# Altium schematic sheet shematic diagram.SchDoc (part 1 of 3)
size A2; SheetNumber: 1; SheetTotal: 1
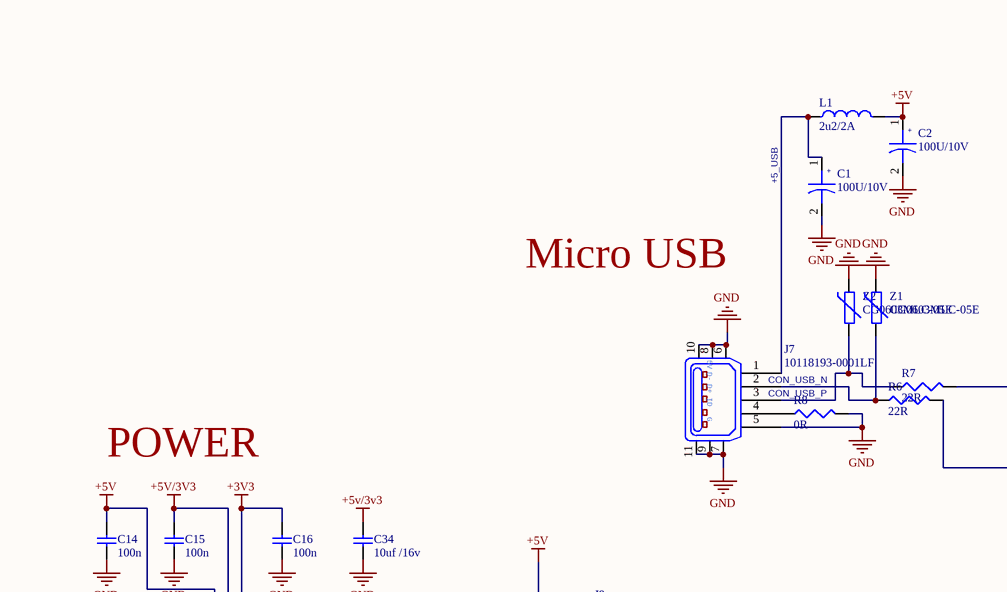
[diagram p0: shematic diagram.SchDoc, top left]
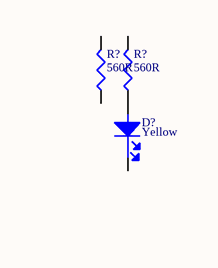
[diagram p1: shematic diagram.SchDoc, top right]
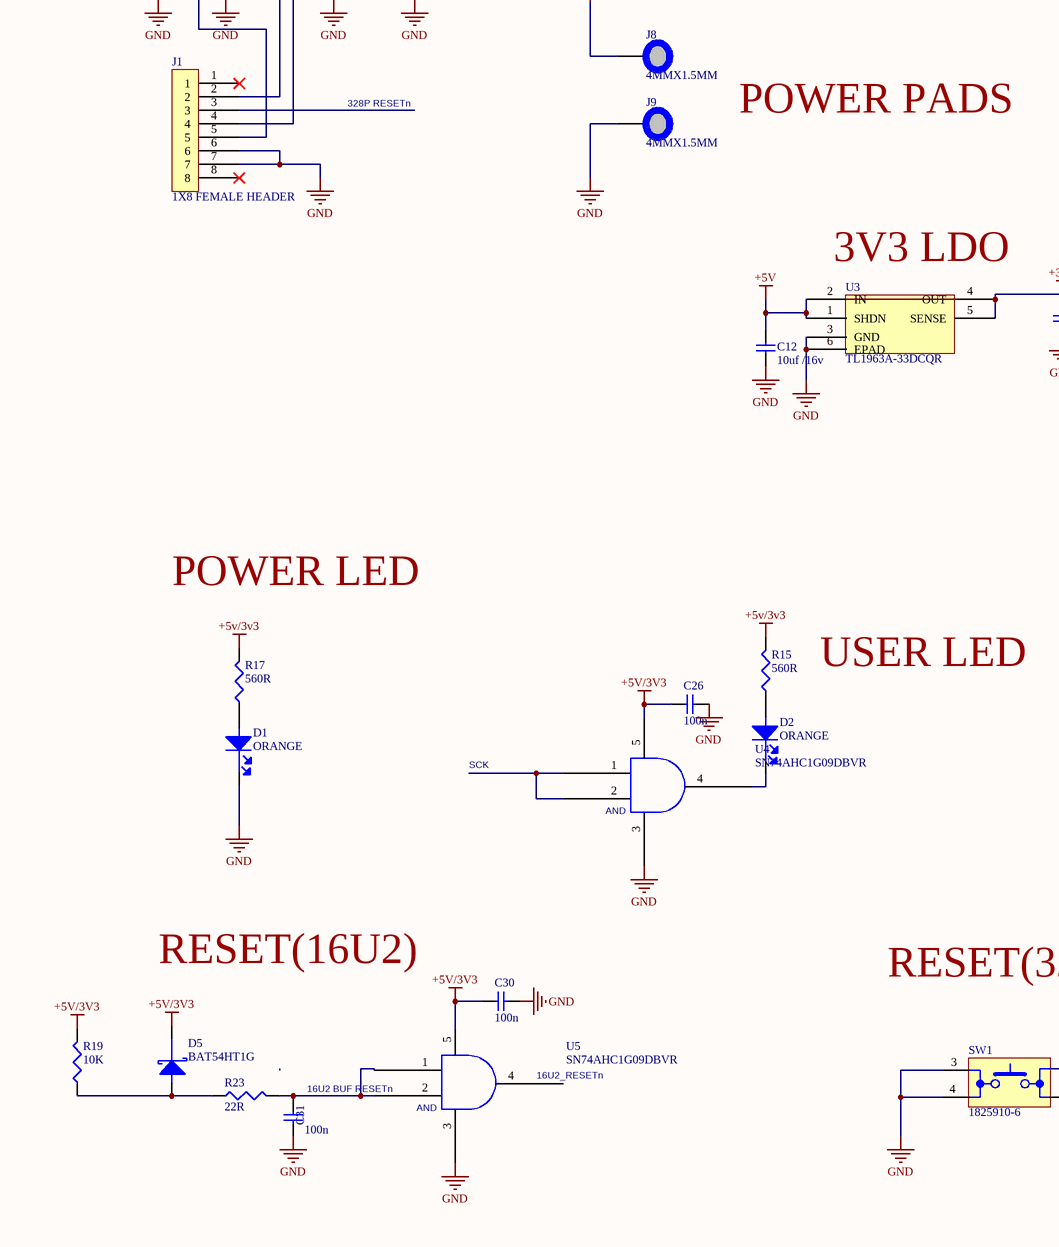
[diagram p2: shematic diagram.SchDoc, bottom left]
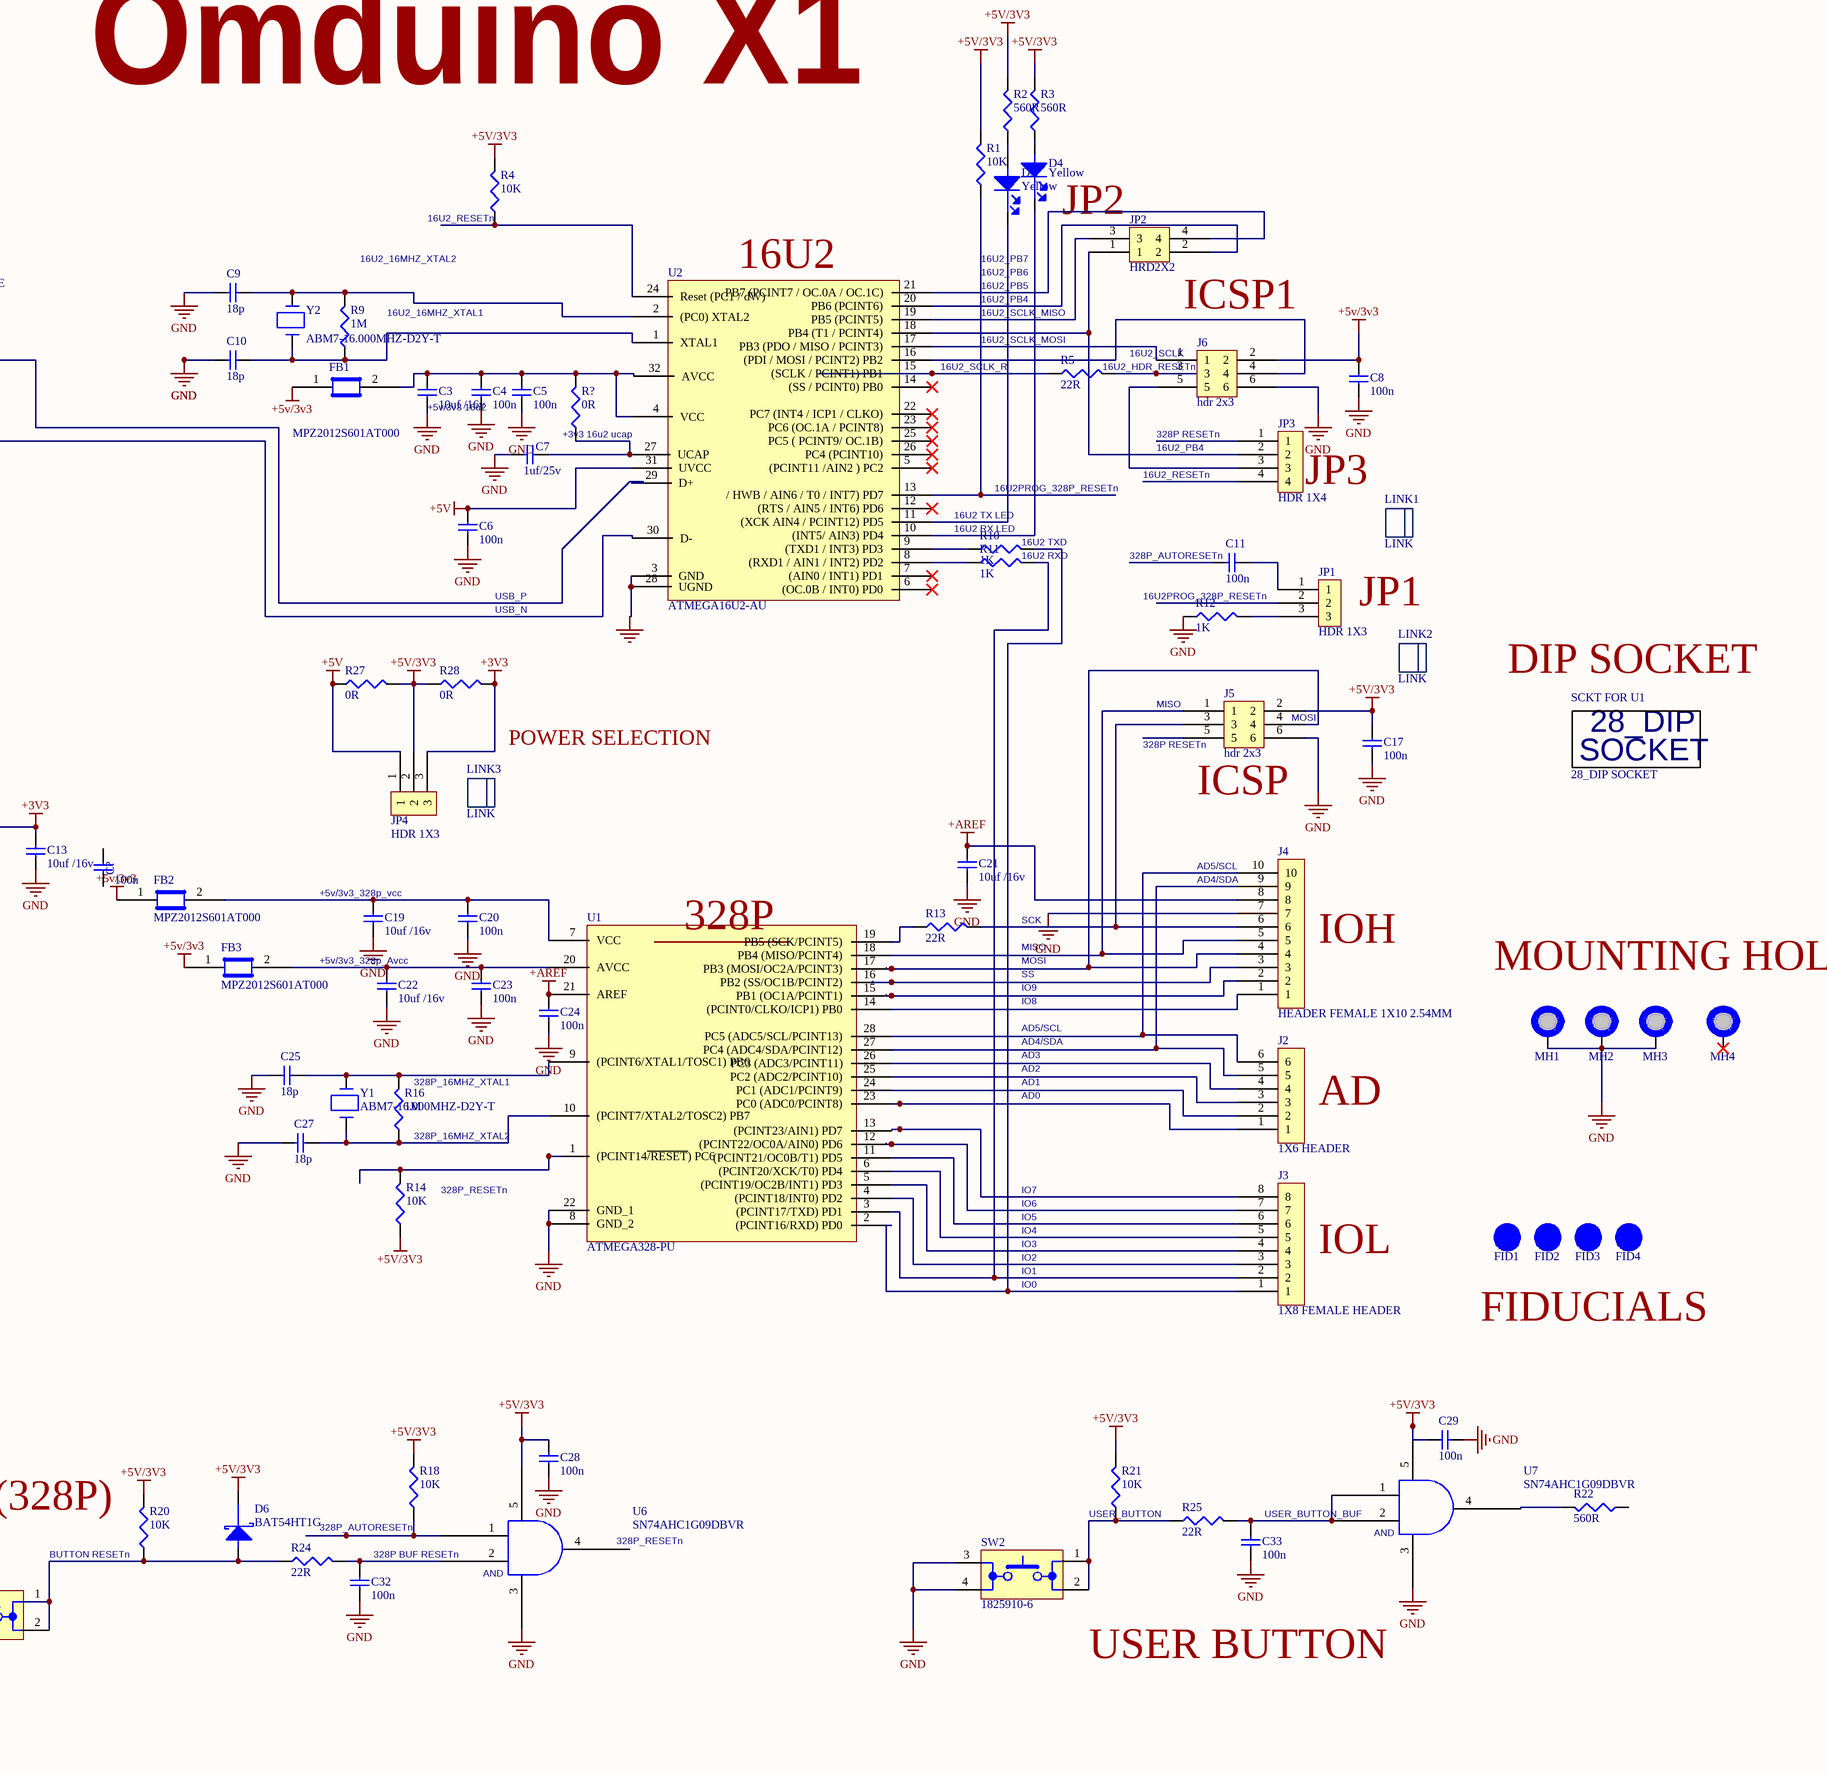
[diagram p3: shematic diagram.SchDoc, bottom right]

## Parts
(Parts that share a designator on the sheet are numbered #1, #2 ... from top to bottom, then left to right.)
C1  100U/10V  [C_ALU_C_SIZE]
C2  100U/10V  [C_ALU_C_SIZE]
C3  10uf /16v  [10uf /c0805 footprint]
C4  100n  [c0805 footprint - duplicate]
C5  100n  [c0805 footprint - duplicate]
C6  100n  [c0805 footprint - duplicate]
C7  1uf/25v  [c0805 footprint - duplicate]
C8  100n  [c0805 footprint - duplicate]
C9  18p  [c0805 footprint - duplicate]
C10  18p  [c0805 footprint - duplicate]
C11  100n  [c0805 footprint - duplicate]
C12  10uf /16v  [10uf /c0805 footprint]
C13  10uf /16v  [10uf /c0805 footprint]
C14  100n  [c0805 footprint - duplicate]
C15  100n  [c0805 footprint - duplicate]
C16  100n  [c0805 footprint - duplicate]
C17  100n  [c0805 footprint - duplicate]
C19  10uf /16v  [10uf /c0805 footprint]
C20  100n  [c0805 footprint - duplicate]
C21  10uf /16v  [10uf /c0805 footprint]
C22  10uf /16v  [10uf /c0805 footprint]
C23  100n  [c0805 footprint - duplicate]
C24  100n  [c0805 footprint - duplicate]
C25  18p  [c0805 footprint - duplicate]
C26  100n  [c0805 footprint - duplicate]
C27  18p  [c0805 footprint - duplicate]
C28  100n  [c0805 footprint - duplicate]
C29  100n  [c0805 footprint - duplicate]
C30  100n  [c0805 footprint - duplicate]
C31  100n  [c0805 footprint - duplicate]
C32  100n  [c0805 footprint - duplicate]
C33  100n  [c0805 footprint - duplicate]
C34  10uf /16v  [10uf /c0805 footprint]
C?  100n  [c0805 footprint - duplicate]
D1  ORANGE  [led_0603]
D2  ORANGE  [led_0603]
D3  Yellow  [led_0603]
D4  Yellow  [led_0603]
D5  BAT54HT1G  [SOD323]
D6  BAT54HT1G  [SOD323]
D?  Yellow  [led_0603]
FB1  MPZ2012S601AT000  [c0805 footprint - duplicate]
FB2  MPZ2012S601AT000  [c0805 footprint - duplicate]
FB3  MPZ2012S601AT000  [c0805 footprint - duplicate]
FID1  FID_1MM  [FID_40X120D]  (value not drawn)  (no BOM)
FID2  FID_1MM  [FID_40X120D]  (value not drawn)  (no BOM)
FID3  FID_1MM  [FID_40X120D]  (value not drawn)  (no BOM)
FID4  FID_1MM  [FID_40X120D]  (value not drawn)  (no BOM)
J1  1X8 FEMALE HEADER  [1x8 femaLE HEADERS - duplicate]
J2  1X6 HEADER  [1x6 femaLE HEADERS]
J3  1X8 FEMALE HEADER  [1x8 femaLE HEADERS - duplicate]
J4  HEADER FEMALE 1X10 2.54MM  [1x10 femaLE HEADERS - duplicate]
J5  hdr 2x3  [hdr 2x3_2.54mm]
J6  hdr 2x3  [hdr 2x3_2.54mm]
J7  10118193-0001LF  [10118193]
J8  4MMX1.5MM  [PAD_WITH_HOLE_4MMX1.5MM]  (no BOM)
J9  4MMX1.5MM  [PAD_WITH_HOLE_4MMX1.5MM]  (no BOM)
JP1  HDR 1X3  [hdr 1x3_2.54mm]
JP2  HRD2X2  [hdr 2x2_2.54mm]
JP3  HDR 1X4  [1x4 femaLE HEADERS]
JP4  HDR 1X3  [hdr 1x3_2.54mm]
L1  2u2/2A  [C1210_IND]
LINK1  LINK  (mechanical)
LINK2  LINK  (mechanical)
LINK3  LINK  (mechanical)
MH1  MH_7.4MMC_3.2_MMD  [MH_7.4MMC_3.2_MMD]  (value not drawn)  (no BOM)
MH2  MH_7.4MMC_3.2_MMD  [MH_7.4MMC_3.2_MMD]  (value not drawn)  (no BOM)
MH3  MH_7.4MMC_3.2_MMD  [MH_7.4MMC_3.2_MMD]  (value not drawn)  (no BOM)
MH4  MH_NOT_COATED_7.4MMNC_3.2MMD  [MH_7.4MMC_3.2_MMD_NON)COPPER_NPTH]  (value not drawn)  (no BOM)
R1  10K  [R0805]
R2  560R  [R0805]
R3  560R  [R0805]
R4  10K  [R0805]
R5  22R  [R0805]
R6  22R  [R0805]
R7  22R  [R0805]
R8  0R  [R0805]
R9  1M  [R0805]
R10  1K  [R0805]
R11  1K  [R0805]
R12  1K  [R0805]
R13  22R  [R0805]
R14  10K  [R0805]
R15  560R  [R0805]
R16  1M  [R0805]
R17  560R  [R0805]
R18  10K  [R0805]
R19  10K  [R0805]
R20  10K  [R0805]
R21  10K  [R0805]
R22  560R  [R0805]
R23  22R  [R0805]
R24  22R  [R0805]
R25  22R  [R0805]
R27  0R  [R0805]
R28  0R  [R0805]
R?#1  560R  [R0805]
R?#2  560R  [R0805]
R?#3  0R  [R0805]
SCKT_FOR_U1  28_DIP SOCKET  [28_DIP_7.6mm_SOCKET]
SW1  1825910-6  [1825910-6]
SW2  1825910-6  [1825910-6]
U1  ATMEGA328-PU  [DIP28 - duplicate]
U2  ATMEGA16U2-AU  [TQFP32]
U3  TL1963A-33DCQR  [DCQ(R-PDSO-G6)]
U4  SN74AHC1G09DBVR  [DBV_SQT_23_5]
U5  SN74AHC1G09DBVR  [DBV_SQT_23_5]
U6  SN74AHC1G09DBVR  [DBV_SQT_23_5]
U7  SN74AHC1G09DBVR  [DBV_SQT_23_5]
Y1  ABM7-16.000MHZ-D2Y-T  [ABM7-v1-1-big]
Y2  ABM7-16.000MHZ-D2Y-T  [ABM7-v1-1-big]
Z1  CG0603MLC-05E  [R0603]
Z2  CG0603MLC-05E  [R0603]

## Nets
+3V3: C13.2 C16.2 J1.4 JP4.3 R28.2 U3.4(OUT) U3.5(SENSE)
+5V: C2.1 C6.2 C12.2 C14.2 J1.5 J8.1 JP4.1 L1.2 R27.1 U2.31(UVCC) U3.1(SHDN) U3.2(IN)
+5V/3V3: C8.2 C15.2 C17.2 C26.1 C28.2 C29.2 C30.2 C34.2 D5.1(CATHODE) D6.1(CATHODE) FB1.1 FB2.1 FB3.1 J1.2 J5.2 J6.2 JP4.2 R1.2 R2.2 R3.2 R4.2 R14.1 R15.2 R17.2 R18.2 R19.2 R20.2 R21.2 R27.2 R28.1 U4.5 U5.5 U6.5 U7.5
+AREF: C21.2 C24.2 J4.8 U1.21(AREF)
GND: C1.2 C2.2 C3.1 C4.1 C5.1 C6.1 C7.1 C8.1 C9.1 C10.1 C12.1 C13.1 C14.1 C15.1 C16.1 C17.1 C19.1 C20.1 C21.1 C22.1 C23.1 C24.1 C25.1 C26.2 C27.1 C28.1 C29.1 C30.1 C31.1 C32.1 C33.1 C34.1 D1.1(CATHODE) J1.6 J1.7 J4.7 J5.6 J6.6 J7.5 J7.6 J7.7 J7.8 J7.9 J7.10 J7.11 J9.1 MH1.1 MH2.1 MH3.1 R8.2 R12.1 SW1.3 SW1.4 SW2.3 SW2.4 U1.8(GND_2) U1.22(GND_1) U2.3(GND) U2.28(UGND) U3.3(GND) U3.6(EPAD) U4.3 U5.3 U6.3 U7.3 Z1.2 Z2.2
NetC1_1: C1.1 J7.1 L1.1
NetC3_2: C3.2 C4.2 C5.2 FB1.2 R?#3.2 U2.4(VCC) U2.32(AVCC)
NetC7_2: C7.2 R?#3.1 U2.27(UCAP)
NetC9_2: C9.2 R9.2 U2.2((PC0)_XTAL2) Y2.2
NetC10_2: C10.2 R9.1 U2.1(XTAL1) Y2.1
NetC11_2: C11.2 JP1.1
NetC19_2: C19.2 C20.2 FB2.2 U1.7(VCC)
NetC22_2: C22.2 C23.2 FB3.2 U1.20(AVCC)
NetC25_2: C25.2 R16.2 U1.9((PCINT6/XTAL1/TOSC1)_PB6) Y1.2
NetC27_2: C27.2 R16.1 U1.10((PCINT7/XTAL2/TOSC2)_PB7) Y1.1
NetC31_2: C31.2 R23.2 U5.1 U5.2
NetC32_2: C32.2 R24.2 U6.2
NetC33_2: C33.2 R25.2 U7.1 U7.2
NetD1_2: D1.2(ANODE) R17.1
NetD2_1: D2.1(CATHODE) U4.4
NetD2_2: D2.2(ANODE) R15.1
NetD3_1: D3.1(CATHODE) U2.11((XCK_AIN4_/_PCINT12)_PD5)
NetD3_2: D3.2(ANODE) R2.1
NetD4_1: D4.1(CATHODE) U2.10((INT5/_AIN3)_PD4)
NetD4_2: D4.2(ANODE) R3.1
NetD5_2: D5.2(ANODE) R19.1 R23.1
NetD6_2: D6.2(ANODE) R20.1 R24.1 SW1.1 SW1.2
NetJ2_1: J2.1 U1.23(PC0_(ADC0/PCINT8))
NetJ2_2: J2.2 U1.24(PC1_(ADC1/PCINT9))
NetJ2_3: J2.3 U1.25(PC2_(ADC2/PCINT10))
NetJ2_4: J2.4 U1.26(PC3_(ADC3/PCINT11))
NetJ2_5: J2.5 J4.9 U1.27(PC4_(ADC4/SDA/PCINT12))
NetJ2_6: J2.6 J4.10 U1.28(PC5_(ADC5/SCL/PCINT13))
NetJ3_1: J3.1 R10.2 U1.2((PCINT16/RXD)_PD0)
NetJ3_2: J3.2 R11.2 U1.3((PCINT17/TXD)_PD1)
NetJ3_3: J3.3 U1.4((PCINT18/INT0)_PD2)
NetJ3_4: J3.4 U1.5((PCINT19/OC2B/INT1)_PD3)
NetJ3_5: J3.5 U1.6((PCINT20/XCK/T0)_PD4)
NetJ3_6: J3.6 U1.11((PCINT21/OC0B/T1)_PD5)
NetJ3_7: J3.7 U1.12((PCINT22/OC0A/AIN0)_PD6)
NetJ3_8: J3.8 U1.13((PCINT23/AIN1)_PD7)
NetJ4_1: J4.1 U1.14((PCINT0/CLKO/ICP1)_PB0)
NetJ4_2: J4.2 U1.15(PB1_(OC1A/PCINT1))
NetJ4_3: J4.3 U1.16(PB2_(SS/OC1B/PCINT2))
NetJ4_4: J4.4 J5.4 U1.17(PB3_(MOSI/OC2A/PCINT3))
NetJ4_5: J4.5 J5.1 U1.18(PB4_(MISO/PCINT4))
NetJ4_6: J4.6 J5.3 R13.2
NetJ6_1: J6.1 U2.17(PB3_(PDO_/_MISO_/_PCINT3))
NetJ6_3: J6.3 R5.2
NetJ6_4: J6.4 U2.16((PDI_/_MOSI_/_PCINT2)_PB2)
NetJ6_5: J6.5 JP3.3
NetJ7_2: J7.2 R6.1 Z1.1
NetJ7_3: J7.3 R7.1 Z2.1
NetJ7_4: J7.4 R8.1
NetJP1_3: JP1.3 R12.2
NetJP2_1: JP2.1 JP3.2 U2.18(PB4_(T1_/_PCINT4))
NetJP2_2: JP2.2 U2.20(PB6_(PCINT6))
NetJP2_3: JP2.3 U2.19(PB5_(PCINT5))
NetJP2_4: JP2.4 U2.21(PB7_(PCINT7_/_OC.0A_/_OC.1C))
NetR1_1: R1.1 U2.13(/_HWB_/_AIN6_/_T0_/_INT7)_PD7)
NetR4_1: R4.1 U2.24(Reset_(PC1_/_dW))
NetR5_1: R5.1 U2.15((SCLK_/_PCINT1)_PB1)
NetR6_2: R6.2 U2.30(D-)
NetR7_2: R7.2 U2.29(D+)
NetR10_1: R10.1 U2.9((TXD1_/_INT3)_PD3)
NetR11_1: R11.1 U2.8((RXD1_/_AIN1_/_INT2)_PD2)
NetR13_1: R13.1 U1.19(PB5_(SCK/PCINT5))
NetR14_2: R14.2 U1.1((PCINT14~{/RESET})_PC6)
NetR18_1: R18.1 U6.1
NetR21_1: R21.1 R25.1 SW2.1 SW2.2
NetR22_2: R22.2 U7.4
NetU4_1: U4.1 U4.2

Not connected (* = marked no-connect by the designer): C11 1; C? 1 2; D? 1(CATHODE) 2(ANODE); J1 1* 3 8*; J5 5; JP1 2; JP3 1 4; MH4 1*; R22 1; R?#1 1 2; R?#2 1 2; U2 5((PCINT11_/AIN2_)_PC2)* 6((OC.0B_/_INT0)_PD0)* 7((AIN0_/_INT1)_PD1)* 12((RTS_/_AIN5_/_INT6)_PD6)* 14((SS_/_PCINT0)_PB0)* 22(PC7_(INT4_/_ICP1_/_CLKO))* 23(PC6_(OC.1A_/_PCINT8))* 25(PC5_(_PCINT9/_OC.1B))* 26(PC4_(PCINT10))*; U5 4; U6 4

## Notes on the sheet
- Omduino X1
- +5_USB
- Micro USB
- (near R4) 16U2_RESETn
- (near JP2) JP2
- (near R9) 16U2_16MHZ_XTAL2
- (near R9) 16U2_16MHZ_XTAL1
- (near U2) 16U2
- 16U2_SCLK_MISO
- 16U2_PB4
- 16U2_PB5
- 16U2_PB6
- 16U2_PB7
- (near JP2) ICSP1
- CON_USB_N
- (near R8) CON_USB_P
- 16U2_SCLK_R
- (near R5) 16U2_SCLK_MOSI
- (near R5) 16U2_HDR_RESETn
- 16U2_SCLK
- POWER
- +5v/3v3 16u2
- (near R?#3) +3v3 16u2 ucap
- 328P RESETn
- 16U2 TX LED
- 16U2PROG_328P_RESETn
- 16U2_RESETn
- JP3
- (near R10) 16U2 RX LED
- (near R10) 16U2 TXD
- 16U2 RXD
- (near C11) 328P_AUTORESETn
- POWER PADS
- USB_P
- USB_N
- (near R12) 16U2PROG_328P_RESETn
- JP1
- (near J5) MISO
- (near J5) MOSI
- DIP SOCKET
- POWER SELECTION
- (near J5) 328P RESETn
- (near U3) 3V3 LDO
- (near J5) ICSP
- (near C19) +5v/3v3_328p_vcc
- SCK
- (near J4) AD5/SCL
- (near J4) AD4/SDA
- (near C22) +5v/3v3_328p_Avcc
- (near U1) 328P
- IO9
- SS
- MOSI
- MISO
- (near J4) IOH
- MOUNTING HOLES
- IO8
- AD3
- AD4/SDA
- AD5/SCL
- POWER LED
- (near R16) 328P_16MHZ_XTAL1
- AD0
- AD1
- AD2
- (near J2) AD
- (near R16) 328P_16MHZ_XTAL2
- (near R14) 328P_RESETn
- IO7
- USER LED
- IO2
- IO3
- IO4
- IO5
- IO6
- (near J3) IOL
- IO0
- IO1
- FIDUCIALS
- RESET(16U2)
- (near R20) RESET(328P)
- 328P_AUTORESETn
- (near R21) USER_BUTTON
- (near C33) USER_BUTTON_BUF
- BUTTON RESETn
- (near C32) 328P BUF RESETn
- 328P_RESETn
- (near C31) 16U2 BUF RESETn
- (near U5) 16U2_RESETn
- (near SW2) USER BUTTON
- (in symbol 4828-3004-CP) 28_DIP; SOCKET
- (in symbol 10118193-0001LF) 5V; D-; D+; ID; G
- (in symbol EEE-1AA101WR) +
- (in symbol SN74AHC1G09DBVR) AND